# Altium schematic sheet czujniki2.SchDoc
size A4; SheetNumber: 2; SheetTotal: 7
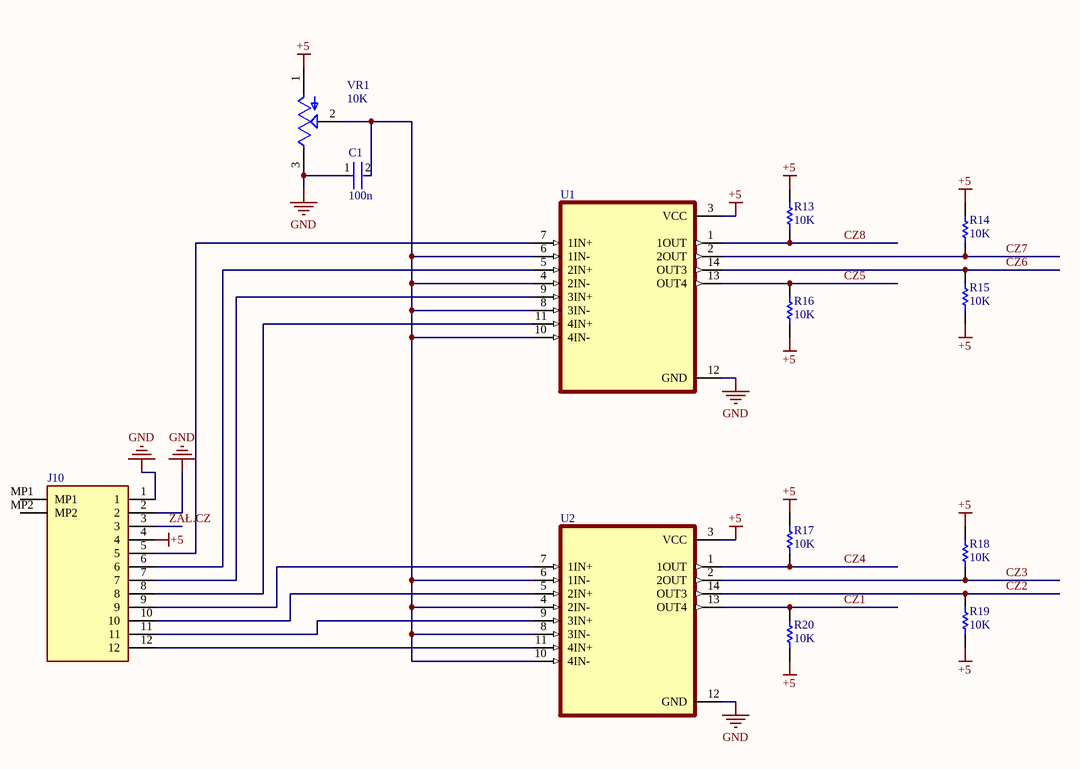
[diagram p0: czujniki2.SchDoc]

## Parts
C1  100n  [FP-0805-L_2_01_0_2-W_1_25-IPC_B]
J10  AFA07-S12FCA-00  [AFA07S12FCA00]  (value not drawn)
R13  10K  [RESC2013X60X35NL10T20]
R14  10K  [RESC2013X60X35NL10T20]
R15  10K  [RESC2013X60X35NL10T20]
R16  10K  [RESC2013X60X35NL10T20]
R17  10K  [RESC2013X60X35NL10T20]
R18  10K  [RESC2013X60X35NL10T20]
R19  10K  [RESC2013X60X35NL10T20]
R20  10K  [RESC2013X60X35NL10T20]
U1  LM339D  [SOIC127P600X175-14N]  (value not drawn)
U2  LM339D  [SOIC127P600X175-14N]  (value not drawn)
VR1  10K  [TRIM_3362P-1-103]

## Nets
+5: J10.4 R13.2 R14.2 R15.1 R16.1 R17.2 R18.2 R19.1 R20.1 U1.3(VCC) U2.3(VCC) VR1.1(CCW)
GND: C1.1 J10.1 J10.2 U1.12(GND) U2.12(GND) VR1.3(CW)
CZ1: R20.2 U2.13(OUT4)
CZ2: R19.2 U2.14(OUT3)
CZ3: R18.1 U2.2(2OUT)
CZ4: R17.1 U2.1(1OUT)
CZ5: R16.2 U1.13(OUT4)
CZ6: R15.2 U1.14(OUT3)
CZ7: R14.1 U1.2(2OUT)
CZ8: R13.1 U1.1(1OUT)
ZAŁ.CZ: J10.3
NetC1_2: C1.2 U1.4(2IN-) U1.6(1IN-) U1.8(3IN-) U1.10(4IN-) U2.4(2IN-) U2.6(1IN-) U2.8(3IN-) U2.10(4IN-) VR1.2(WIPER)
NetJ10_5: J10.5 U1.7(1IN+)
NetJ10_6: J10.6 U1.5(2IN+)
NetJ10_7: J10.7 U1.9(3IN+)
NetJ10_8: J10.8 U1.11(4IN+)
NetJ10_9: J10.9 U2.7(1IN+)
NetJ10_10: J10.10 U2.5(2IN+)
NetJ10_11: J10.11 U2.9(3IN+)
NetJ10_12: J10.12 U2.11(4IN+)

Not connected (* = marked no-connect by the designer): J10 MP1 MP2

## Library data of the parts
C1 = CMP-2007-04174-2: General Purpose Ceramic Capacitor, 0805, 100nF, 10%, X7R, 15%, 100V; Packaging: Tape and Reel; Min Operating Temperature: -55°C; Dielectric Material: Ceramic; Height: 1.4mm; Voltage Rating: 100V; Termination: SMD/SMT; Case Code (Imperial): 0805; Case Code (Metric): 2012; Case/Package: 0805; Construction: Flat; Radiation Hardening: No; Series: -; Dielectric: X7R; Package Quantity: 2000; Mount: Surface Mount; Capacitance: 100nF; Contact Plating: Tin; Voltage: 100V; Lead Free: Lead Free; Depth: 1.25mm; RoHS Compliant: Yes; Number of Pins: 2; Max Operating Temperature: 125°C; Length: 2.01mm; Voltage Rating (DC): 100V; Thickness: 0.055inch; REACH SVHC: No SVHC; Width: 0.049inch; Tolerance: 10%
J10 = AFA07-S12FCA-00: FFC, FPC Connectors P=1mm RoHS; Manufacturer_Name: JUSHUO; Geometry.Height: 2.6mm; Manufacturer_Part_Number: AFA07-S12FCA-00; Mouser Part Number: *; Mouser Price/Stock: *; Arrow Part Number: *; Arrow Price/Stock: *; Datasheet Link: https://datasheet.lcsc.com/szlcsc/JUSHUO-AFA07-S12FCA-00_C262718.pdf
R13-R20 = CMP-1659-00013-4: Chip Resistor, 10 KOhm, +/- 1%, 0.125 W, -55 to 155 degC, 0805 (2012 Metric), RoHS, Tape and Reel; Manufacturer: Yageo; Voltage Rating: 150 V; Mount: Surface Mount; ComponentLink1Description: Manufacturer URL; ComponentLink2URL: http://www.yageo.com/documents/recent/PYu-RC_Group_51_RoHS_L_04.pdf; Pins: 2; Length: 2 mm; Min Operating Temperature: -55 degC; Height: 0.5 mm; Mounting Technology: Surface Mount; RoHSCompliant: true; REACH SVHC: No SVHC; ComponentLink1URL: http://www.yageo.com/; Max Operating Temperature: 155 degC; PackageReference: 0805; DatasheetVersion: Rev. 4, 02/2016; Package Quantity: 5000; Packaging: Tape and Reel; ComponentLink2Description: Datasheet; PackageDescription: 2-Pin Surface Mounted Device, Body 2 x 1.25 mm
VR1 = 3362P-1-103: 10 kOhms 0.5W, 1/2W PC Pins Through Hole Trimmer Potentiometer Cermet 1 Turn Top Adjustment; MF: Bourns; Availability: Unavailable; Check_prices: https://www.snapeda.com/parts/3362P-1-103/Bourns/view-part/1483042/?ref=eda; Package: 3116 Bourns; Price: None; SnapEDA_Link: https://www.snapeda.com/parts/3362P-1-103/Bourns/view-part/1483042/?ref=snap; Value: *; MP: 3362P-1-103
U1 U2 = LM339D: Price: None; Value: *; Package: None; Availability: Unavailable; MP: LM339D